# Altium schematic sheet MCU023_MSP432E_Ethernet_Power.SchDoc
size 431 x 279 mm; Date: Not shown in title block; ApprovedBy: Not shown in title block; CheckedBy: Not shown in title block; Author: Not shown in title block; CompanyName: Not shown in title block; Engineer: Not shown in title block; Organization: Not shown in title block; Address1: Not shown in title block; Address2: Not shown in title block; Address3: Not shown in title block; Address4: Not shown in title block; DocumentNumber: 1; Revision: Use project parameter SCH_Rev; SheetNumber: 2; SheetTotal: 6; PageSetup: Record=PageOptions|CenterHorizontal=True|CenterVertical=True|PrintScale=1.00|XCorrection=1.00|YCorrection=1.00|PrintKind=0|BorderSize=5000000|LeftOffset=0|BottomOffset=0|Orientation=2|PaperLength=1000|PaperWidth=1000|Scale=100|PaperSource=15|PrintQuality=600|MediaType=1|DitherType=10|PaperKind=Letter|PrintScaleMode=1; CurrentTime: Not shown in title block; CurrentDate: Not shown in title block; Time: Not shown in title block; DocumentFullPathAndName: Not shown in title block; DocumentName: Not shown in title block; ModifiedDate: Not shown in title block; ImagePath: Not shown in title block
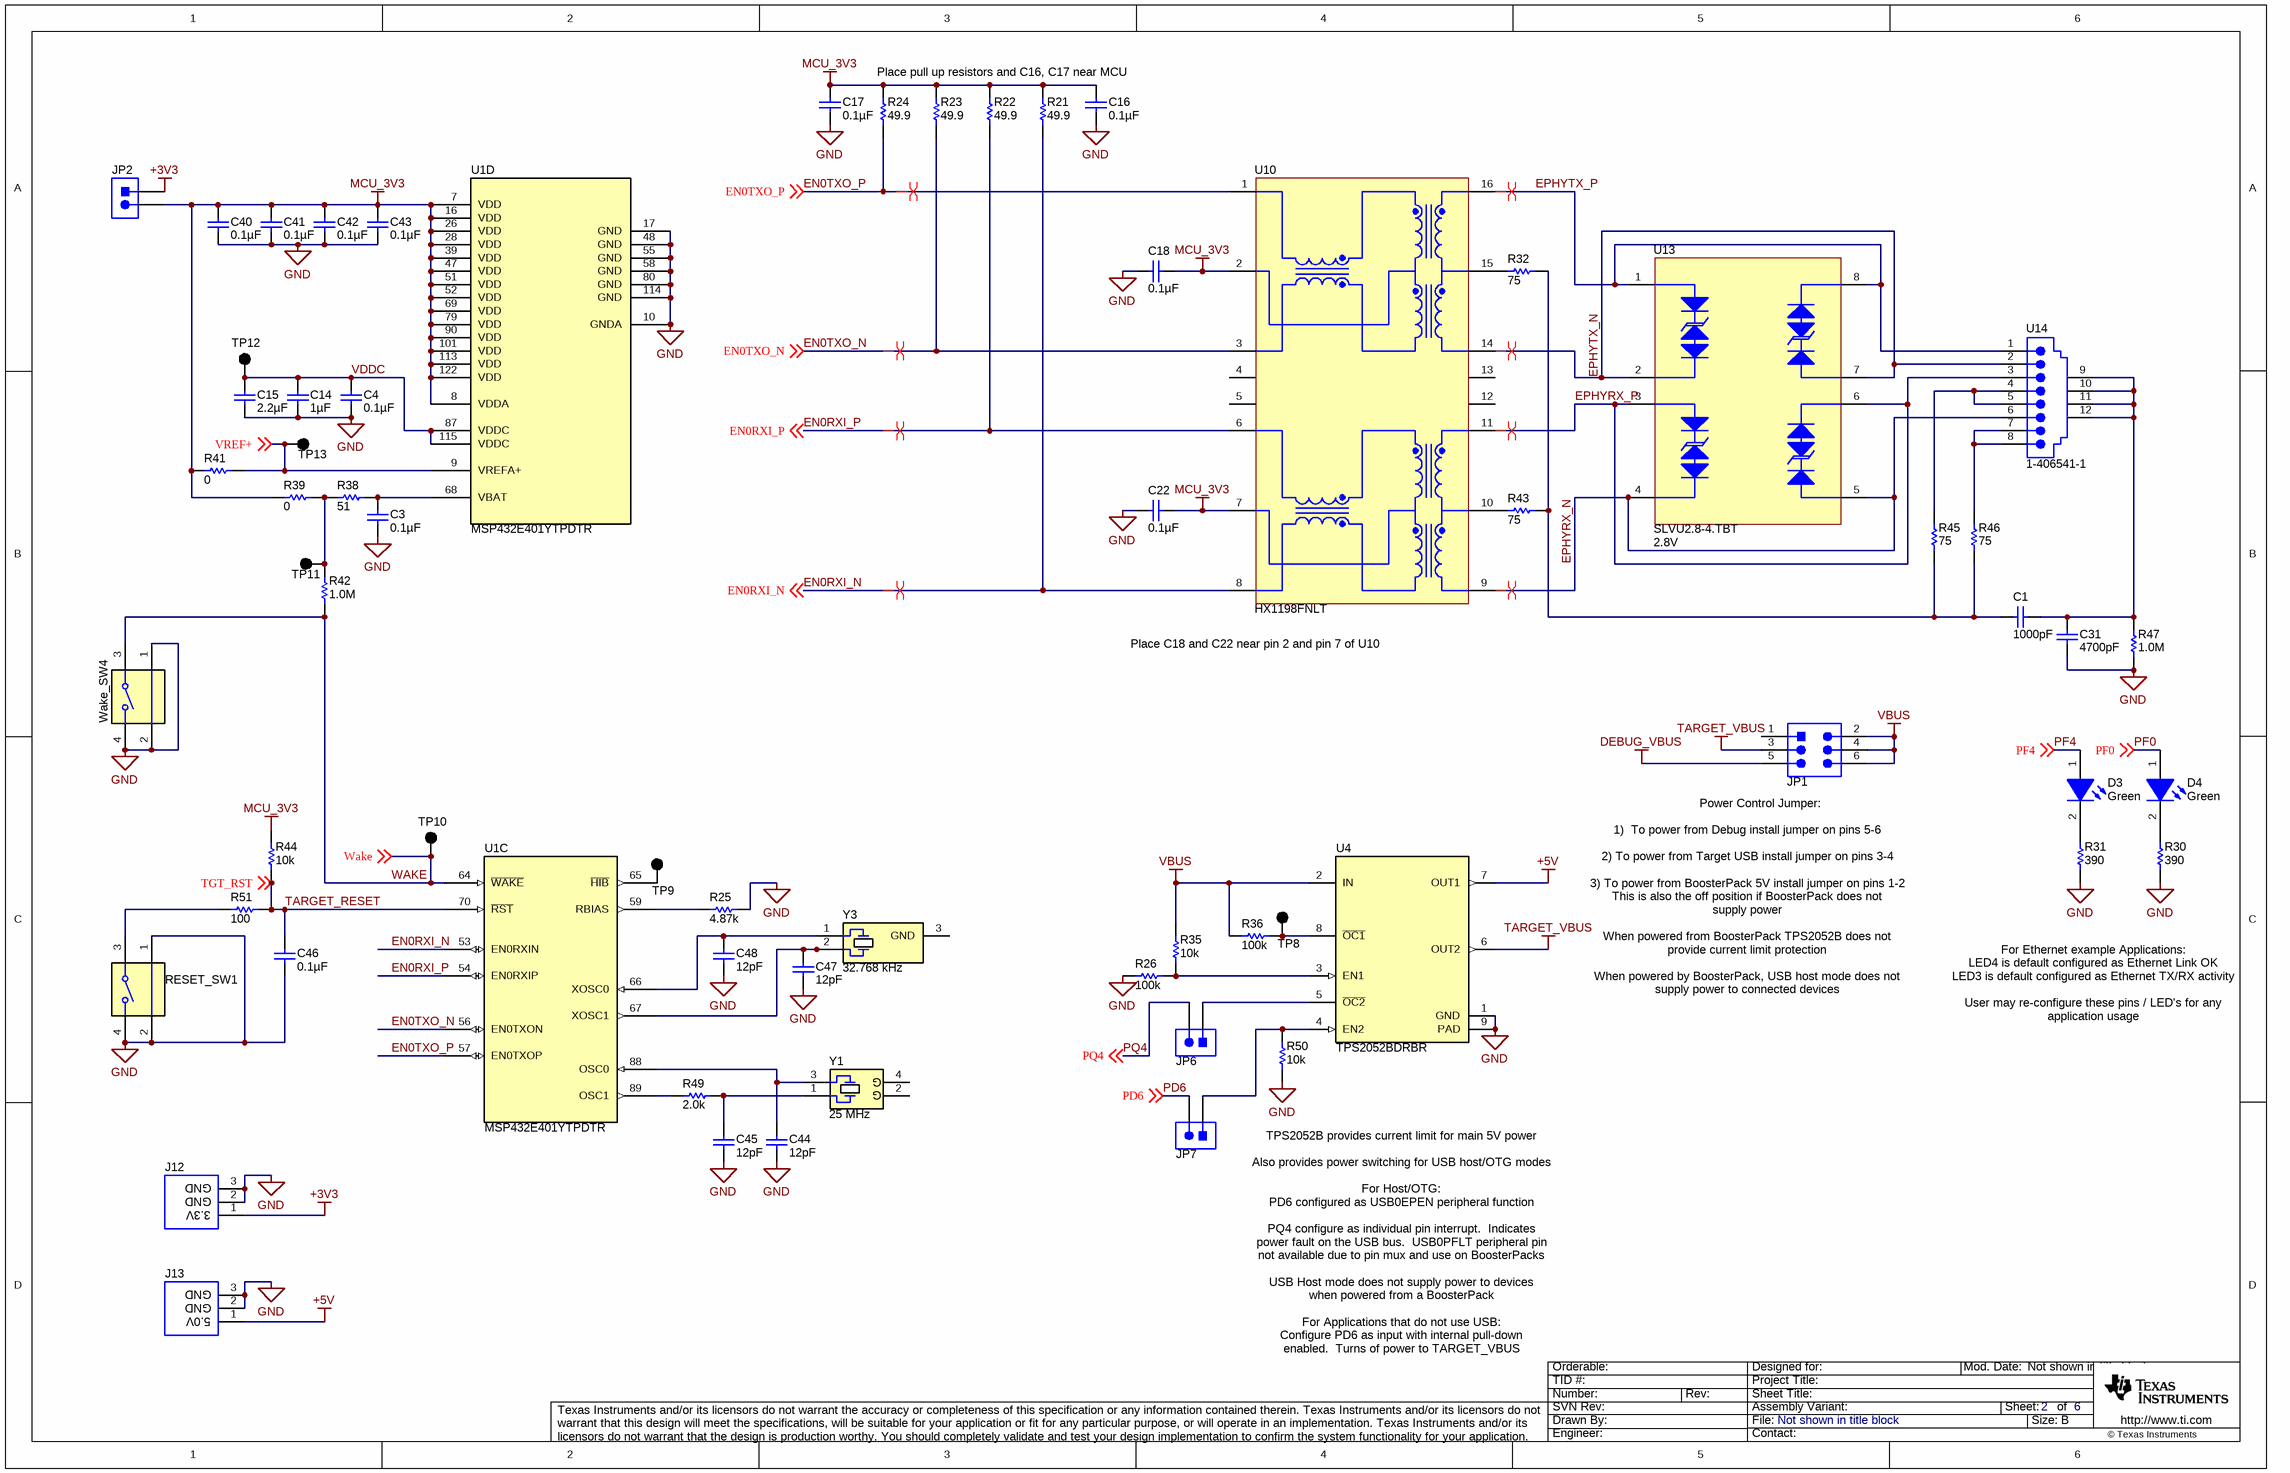
[diagram p0: MCU023_MSP432E_Ethernet_Power.SchDoc]

## Parts
C1  ValueDisplayed: 1000pF  [1210_270]  (hidden comment: C1210C102KGRACTU)
C3  ValueDisplayed: 0.1µF  [0402]  (hidden comment: GRM155R71C104KA88D)
C4  ValueDisplayed: 0.1µF  [0402]  (hidden comment: GRM155R71C104KA88D)
C14  ValueDisplayed: 1µF  [0402]  (hidden comment: GRM155R61A105KE15D)
C15  ValueDisplayed: 2.2µF  [0603]  (hidden comment: GRM188R61C225KE15D)
C16  ValueDisplayed: 0.1µF  [0402]  (hidden comment: GRM155R71C104KA88D)
C17  ValueDisplayed: 0.1µF  [0402]  (hidden comment: GRM155R71C104KA88D)
C18  ValueDisplayed: 0.1µF  [0402]  (hidden comment: GRM155R71C104KA88D)
C22  ValueDisplayed: 0.1µF  [0402]  (hidden comment: GRM155R71C104KA88D)
C31  ValueDisplayed: 4700pF  [1812_254]  (hidden comment: 1812GC472KAT1A)
C40  ValueDisplayed: 0.1µF  [0402]  (hidden comment: GRM155R71C104KA88D)
C41  ValueDisplayed: 0.1µF  [0402]  (hidden comment: GRM155R71C104KA88D)
C42  ValueDisplayed: 0.1µF  [0402]  (hidden comment: GRM155R71C104KA88D)
C43  ValueDisplayed: 0.1µF  [0402]  (hidden comment: GRM155R71C104KA88D)
C44  ValueDisplayed: 12pF  [0402]  (hidden comment: GRM1555C1H120JA01D)
C45  ValueDisplayed: 12pF  [0402]  (hidden comment: GRM1555C1H120JA01D)
C46  ValueDisplayed: 0.1µF  [0402]  (hidden comment: GRM155R71C104KA88D)
C47  ValueDisplayed: 12pF  [0402]  (hidden comment: GRM1555C1H120JA01D)
C48  ValueDisplayed: 12pF  [0402]  (hidden comment: GRM1555C1H120JA01D)
D3  value Green  [LED_LTST-C190]  (hidden comment: LTST-C190GKT)
D4  value Green  [LED_LTST-C190]  (hidden comment: LTST-C190GKT)
J12  PEC03SAAN  [PEC03SAAN_Launchpad_3V3]  (value not drawn)
J13  PEC03SAAN  [PEC03SAAN_Launchpad_5V0]  (value not drawn)
JP1  PEC03DAAN  [SULLINS_PEC03DAAN]  (value not drawn)
JP2  PEC02SAAN  [CONN_PEC02SAAN]  (value not drawn)
JP6  PEC02SAAN  [CONN_PEC02SAAN]  (value not drawn)
JP7  PEC02SAAN  [CONN_PEC02SAAN]  (value not drawn)
R21  ValueDisplayed: 49.9  [0402]  (hidden comment: CRCW040249R9FKED)
R22  ValueDisplayed: 49.9  [0402]  (hidden comment: CRCW040249R9FKED)
R23  ValueDisplayed: 49.9  [0402]  (hidden comment: CRCW040249R9FKED)
R24  ValueDisplayed: 49.9  [0402]  (hidden comment: CRCW040249R9FKED)
R25  ValueDisplayed: 4.87k  [0402]  (hidden comment: CRCW04024K87FKED)
R26  ValueDisplayed: 100k  [0402]  (hidden comment: CRCW0402100KJNED)
R30  ValueDisplayed: 390  [0402]  (hidden comment: CRCW0402390RJNED)
R31  ValueDisplayed: 390  [0402]  (hidden comment: CRCW0402390RJNED)
R32  ValueDisplayed: 75  [0402]  (hidden comment: CRCW040275R0JNED)
R35  ValueDisplayed: 10k  [0402]  (hidden comment: CRCW040210K0JNED)
R36  ValueDisplayed: 100k  [0402]  (hidden comment: CRCW0402100KJNED)
R38  ValueDisplayed: 51  [0402]  (hidden comment: CRCW040251R0JNED)
R39  ValueDisplayed: 0  [0402]  (hidden comment: ERJ-2GE0R00X)
R41  ValueDisplayed: 0  [0402]  (hidden comment: ERJ-2GE0R00X)
R42  ValueDisplayed: 1.0M  [0402]  (hidden comment: CRCW04021M00JNED)
R43  ValueDisplayed: 75  [0402]  (hidden comment: CRCW040275R0JNED)
R44  ValueDisplayed: 10k  [0402]  (hidden comment: CRCW040210K0JNED)
R45  ValueDisplayed: 75  [0402]  (hidden comment: CRCW040275R0JNED)
R46  ValueDisplayed: 75  [0402]  (hidden comment: CRCW040275R0JNED)
R47  ValueDisplayed: 1.0M  [1206]  (hidden comment: CRCW12061M00JNEA)
R49  ValueDisplayed: 2.0k  [0402]  (hidden comment: CRCW04022K00JNED)
R50  ValueDisplayed: 10k  [0402]  (hidden comment: CRCW040210K0JNED)
R51  ValueDisplayed: 100  [0402]  (hidden comment: CRCW0402100RJNED)
RESET_SW1  1188E-1K2-V-TR  [SW_1188E]  (value not drawn)
TP8  5001  [Keystone5001]  (value not drawn)
TP9  5001  [Keystone5001]  (value not drawn)
TP10  5001  [Keystone5001]  (value not drawn)
TP11  5001  [Keystone5001]  (value not drawn)
TP12  5001  [Keystone5001]  (value not drawn)
TP13  5001  [Keystone5001]  (value not drawn)
U1  MSP432E401YTPDTR  [PDT0128A]  (parts C,D of 4)
U4  TPS2052BDRBR  [DRB0008B]
U10  HX1198FNLT  [Pulse_HX1198FNLT]
U13  SLVU2.8-4.TBT  value 2.8V  [SOIC-8]
U14  1-406541-1  [TEC_1-406541-1]
Wake_SW4  1188E-1K2-V-TR  [SW_1188E]  (value not drawn)
Y1  Frequency_Fixed: 25 MHz  [NDK_NX3225GA]  (hidden comment: NX3225GA-25.000M-STD-CRG-2)
Y3  Frequency_Fixed: 32.768 kHz  [CFM_CMR200T]  (hidden comment: CMR200T-32.768KDZY-UT)

## Nets
+3V3: J12.1 JP2.1
+5V: J13.1 U4.7(OUT1)
DEBUG_VBUS: JP1.5
GND: C3.1 C4.1 C14.2 C15.2 C16.1 C17.1 C18.2 C22.2 C31.2 C40.1 C41.1 C42.1 C43.1 C44.2 C45.2 C46.1 C47.2 C48.2 J12.2 J12.3 J13.2 J13.3 R25.2 R26.1 R30.1 R31.1 R47.1 R50.1 RESET_SW1.1 RESET_SW1.2 RESET_SW1.4 U1.10(GNDA) U1.17(GND) U1.48(GND) U1.55(GND) U1.58(GND) U1.80(GND) U1.114(GND) U4.1(GND) U4.9(PAD) Wake_SW4.1 Wake_SW4.2 Wake_SW4.4
MCU_3V3: C16.2 C17.2 C18.1 C22.1 C40.2 C41.2 C42.2 C43.2 JP2.2 R21.2 R22.2 R23.2 R24.2 R39.1 R41.1 R44.2 U1.7(VDD) U1.8(VDDA) U1.16(VDD) U1.26(VDD) U1.28(VDD) U1.39(VDD) U1.47(VDD) U1.51(VDD) U1.52(VDD) U1.69(VDD) U1.79(VDD) U1.90(VDD) U1.101(VDD) U1.113(VDD) U1.122(VDD) U10.2(TCT) U10.7(RCT)
TARGET_VBUS: JP1.3 U4.6(OUT2)
VBUS: JP1.2 JP1.4 JP1.6 R35.2 R36.2 U4.2(IN)
EN0RXI_N: R21.1 U1.53(EN0RXIN) U10.8(RD-) ; off-sheet EN0RXI_N
EN0RXI_P: R22.1 U1.54(EN0RXIP) U10.6(RD+) ; off-sheet EN0RXI_P
EN0TXO_N: R23.1 U1.56(EN0TXON) U10.3(TD-) ; off-sheet EN0TXO_N
EN0TXO_P: R24.1 U1.57(EN0TXOP) U10.1(TD+) ; off-sheet EN0TXO_P
EPHYRX_N: U10.9(RX-) U13.4 U13.5 U14.6
EPHYRX_P: U10.11(RX+) U13.3 U13.6 U14.3
EPHYTX_N: U10.14(TX-) U13.2 U13.7 U14.2
EPHYTX_P: U10.16(TX+) U13.1 U13.8 U14.1
PD6: JP7.2 ; off-sheet PD6
PF0: D4.1(A) ; off-sheet PF0
PF4: D3.1(A) ; off-sheet PF4
PQ4: JP6.2 ; off-sheet PQ4
TARGET_RESET: C46.2 R44.1 R51.2 U1.70(~{RST}) ; off-sheet TGT_RST  [also labelled TGT_RST]
VDDC: C4.2 C14.1 C15.1 TP12.1 U1.87(VDDC) U1.115(VDDC)
VREF+: R41.2 TP13.1 U1.9(VREFA+) ; off-sheet VREF+
WAKE: R42.1 TP10.1 U1.64(~{WAKE}) Wake_SW4.3 ; off-sheet Wake
NetC1_1: C1.1 R32.1 R43.1 R45.1 R46.1
NetC1_2: C1.2 C31.1 R47.2 U14.9 U14.10 U14.11 U14.12
NetC3_2: C3.2 R38.1 U1.68(VBAT)
NetC44_1: C44.1 U1.88(OSC0) Y1.3
NetC45_1: C45.1 R49.2 Y1.1
NetC47_1: C47.1 U1.67(XOSC1) Y3.2
NetC48_1: C48.1 U1.66(XOSC0) Y3.1
NetD3_2: D3.2(K) R31.2
NetD4_2: D4.2(K) R30.2
NetJP6_1: JP6.1 U4.5(~{OC2})
NetJP7_1: JP7.1 R50.2 U4.4(EN2)
NetR25_1: R25.1 U1.59(RBIAS)
NetR26_2: R26.2 R35.1 U4.3(EN1)
NetR32_2: R32.2 U10.15(CMT)
NetR36_1: R36.1 TP8.1 U4.8(~{OC1})
NetR38_2: R38.2 R39.2 R42.2 TP11.1
NetR43_2: R43.2 U10.10(CMT)
NetR45_2: R45.2 U14.4 U14.5
NetR46_2: R46.2 U14.7 U14.8
NetR49_1: R49.1 U1.89(OSC1)
NetR51_1: R51.1 RESET_SW1.3
NetTP9_1: TP9.1 U1.65(~{HIB})

Not connected (* = marked no-connect by the designer): JP1 1; U10 4(NC) 5(NC) 12(NC) 13(NC); Y1 2(GND) 4(GND); Y3 3(GND)

## Layout directives
differential pair: EN0RXI_N, EN0RXI_P, EN0TXO_N, EN0TXO_P, EPHYRX_N, EPHYRX_P, EPHYTX_N, EPHYTX_P

## Notes on the sheet
- Place pull up resistors and C16, C17 near MCU
- (near U10) Place C18 and C22 near pin 2 and pin 7 of U10
- 1)  To power from Debug install jumper on pins 5-6
- (near JP1) Power Control Jumper:
- 2) To power from Target USB install jumper on pins 3-4
- 3) To power from BoosterPack 5V install jumper on pins 1-2
- This is also the off position if BoosterPack does not
- supply power
- When powered from BoosterPack TPS2052B does not
- provide current limit protection
- For Ethernet example Applications:
- LED4 is default configured as Ethernet Link OK
- When powered by BoosterPack, USB host mode does not
- supply power to connected devices
- LED3 is default configured as Ethernet TX/RX activity
- User may re-configure these pins / LED's for any
- application usage
- TPS2052B provides current limit for main 5V power
- Also provides power switching for USB host/OTG modes
- For Host/OTG:
- PD6 configured as USB0EPEN peripheral function
- PQ4 configure as individual pin interrupt.  Indicates
- power fault on the USB bus.  USB0PFLT peripheral pin
- not available due to pin mux and use on BoosterPacks
- USB Host mode does not supply power to devices
- when powered from a BoosterPack
- For Applications that do not use USB:
- Configure PD6 as input with internal pull-down
- enabled.  Turns of power to TARGET_VBUS
- Drawn By:
- SVN Rev:
- Number:
- TID #:
- Orderable:
- Rev:
- Sheet Title:
- File:
- Project Title:
- Designed for:
- Assembly Variant:
- Mod. Date:
- Sheet:
- Size:
- of
- B
- http://www.ti.com
- Texas Instruments and/or its licensors do not warrant the accuracy or completeness of this specification or any information contained therein. Texas Instruments and/or its licensors do not warrant that this design will meet the specifications, will be suitable for your application or fit for any particular purpose, or will operate in an implementation. Texas Instruments and/or its licensors do not warrant that the design is production worthy. You should completely validate and test your design implementation to confirm the system functionality for your application.
- Engineer:
- Contact:
- © Texas Instruments
- (in symbol NX3225GA-25.000M-STD-CRG-2) G
- (in symbol PEC03SAAN) GND; 5.0V; 3.3V

## Library data of the parts
C1 = C1210C102KGRACTU: CAP, CERM, 1000 pF, 2000 V, +/- 10%, X7R, 1210; Manufacturer: Kemet; Polarized: N; CompType: Capacitor; Value: 1000pF; U/M: EA; Cap_F: 0.000000001; Tolerance_%: 10; Value1: Unknown; VDC_V: 2000; Value2: 2000V; TaMin_C: -55; TaMax_C: 125; Cap_Case: 1210; SizeArea_mm2: 8; SizeAreaWB_mm2: 14.7; SizeX_mm: 3.2; SizeY_mm: 2.5; SizeZ_mm: 2.7; AEC Category: Q200; SymbolVersion: 2008-07-09; PartNumber: C1210C102KGRACTU; PackageReference: 1210; RoHS: Y; MountType: SMT; Technology: Ceramic; TempCo: X7R; Published: 2008-06-19; Publisher: Texas Instruments; LatestRevisionDate: 2017-04-12; ComponentLink1Description: Datasheet link; ComponentLink1URL: http://www.kemet.com/kemet/web/homepage/kechome.nsf/vapubfiles/KEM_C1010_X7R_HV_SMD.pdf/$file/KEM_C1010_X7R_HV_SMD.pdf; Supplier 1: Digi-Key; Supplier Part Number 1: 399-7095-1-ND; Supplier 2: Newark; Supplier Part Number 2: 24J4631; Supplier 3: Mouser; Supplier Part Number 3: 80-C1210C102KGR; AEC Qualified: N; AEC Grade: N/A
C3 C4 C16-C18 C22 C40-C43 C46 = GRM155R71C104KA88D: CAP, CERM, 0.1 µF, 16 V, +/- 10%, X7R, 0402; Manufacturer: MuRata; Polarized: N; CompType: Capacitor; Value: 0.1uF; U/M: EA; Cap_F: 0.0000001; Tolerance_%: 10; Value1: Unknown; VDC_V: 16; Value2: 16V; TaMin_C: -55; TaMax_C: 125; SizeArea_mm2: 0.5; SizeAreaWB_mm2: 3; SizeX_mm: 1; SizeZ_mm: 0.6; AEC Category: Q200; SymbolVersion: 2008-07-09; PartNumber: GRM155R71C104KA88D; PackageReference: 0402; RoHS: Y; MountType: SMT; Technology: Ceramic; TempCo: X7R; Cap_Case: 0402; SizeY_mm: 0.5; Published: 2008-06-19; Publisher: Texas Instruments; LatestRevisionDate: 2017-04-07; ComponentLink1Description: Datasheet link; ComponentLink1URL: http://search.murata.co.jp/Ceramy/PnsearchViewAction.do?HnOFG=ON&HnNFG=ON&SEL_CNT=50&sLang=en&sKey=GRM155R71C104KA88D&x=9&y=9&search=startwith; Supplier 1: Digi-Key; Supplier Part Number 1: 490-3261-1-ND; Supplier 2: Newark; Supplier Part Number 2: 38K1647; Supplier 3: Mouser; Supplier Part Number 3: 81-GRM155R71C104KA88; AEC Qualified: ?
C14 = GRM155R61A105KE15D: CAP, CERM, 1 µF, 10 V, +/- 10%, X5R, 0402; Manufacturer: MuRata; Polarized: N; CompType: Capacitor; Value: 1uF; U/M: EA; Cap_F: 0.000001; Tolerance_%: 10; Value1: Unknown; Value2: 10V; TaMin_C: -55; TaMax_C: 85; SizeArea_mm2: 0.5; SizeAreaWB_mm2: 3; SizeX_mm: 1; SizeZ_mm: 0.6; AEC Category: Q200; SymbolVersion: 2008-07-09; PartNumber: GRM155R61A105KE15D; PackageReference: 0402; RoHS: Y; VDC_V: 10; MountType: SMT; Technology: Ceramic; TempCo: X5R; Cap_Case: 0402; SizeY_mm: 0.5; Published: 2008-06-19; Publisher: Texas Instruments; LatestRevisionDate: 2017-04-12; ComponentLink1Description: Datasheet link; ComponentLink1URL: http://search.murata.co.jp/Ceramy/PnsearchViewAction.do?HnOFG=ON&HnNFG=ON&SEL_CNT=50&sLang=en&sKey=GRM155R61A105KE15D&x=9&y=9&search=startwith; Supplier 1: Digi-Key; Supplier Part Number 1: 490-3890-1-ND; Supplier 2: Mouser; Supplier Part Number 2: 81-GRM155R61A105KE15; Supplier 3: Farnell; Supplier Part Number 3: 1735523; AEC Qualified: ?
C15 = GRM188R61C225KE15D: CAP, CERM, 2.2 µF, 16 V, +/- 10%, X5R, 0603; Manufacturer: MuRata; Polarized: N; CompType: Capacitor; Value: 2.2uF; U/M: EA; Cap_F: 0.0000022; Tolerance_%: 10; Value1: Unknown; VDC_V: 16; Value2: 16V; TaMin_C: -55; TaMax_C: 85; SizeArea_mm2: 1.28; SizeAreaWB_mm2: 4.68; SizeX_mm: 1.6; SizeY_mm: 0.8; SizeZ_mm: 1; AEC Category: Q200; SymbolVersion: 2008-07-09; PartNumber: GRM188R61C225KE15D; PackageReference: 0603; RoHS: Y; MountType: SMT; Technology: Ceramic; TempCo: X5R; Cap_Case: 0603; Published: 2008-06-19; Publisher: Texas Instruments; LatestRevisionDate: 2017-04-12; ComponentLink1Description: Datasheet link; ComponentLink1URL: http://psearch.murata.com/capacitor/product/GRM188R61C225KE15%23.pdf; Supplier 1: Digi-Key; Supplier Part Number 1: 490-3296-1-ND; Supplier 2: Mouser; Supplier Part Number 2: 81-GRM188R61C225KE15; Supplier 3: Farnell; Supplier Part Number 3: 1735526; AEC Qualified: ?
C31 = 1812GC472KAT1A: CAP, CERM, 4700 pF, 2000 V, +/- 10%, X7R, 1812; Manufacturer: AVX; Polarized: N; CompType: Capacitor; Value: 4700pF; U/M: EA; Cap_F: 0.0000000047; Tolerance_%: 10; Value1: Unknown; VDC_V: 2000; Value2: 2000V; TaMin_C: -55; TaMax_C: 125; Cap_Case: 1812; SizeArea_mm2: 14.4; SizeAreaWB_mm2: 23.1; SizeX_mm: 4.5; SizeY_mm: 3.2; SizeZ_mm: 2.54; AEC Category: Q200; SymbolVersion: 2008-07-09; PartNumber: 1812GC472KAT1A; PackageReference: 1812; RoHS: Y; MountType: SMT; Technology: Ceramic; TempCo: X7R; Published: 2008-06-19; Publisher: Texas Instruments; LatestRevisionDate: 2017-04-12; ComponentLink1Description: Datasheet link; ComponentLink1URL: http://datasheets.avx.com/AVX-HV_MLCC.pdf; Supplier 1: Digi-Key; Supplier Part Number 1: 478-3003-1-ND; Supplier 2: Newark; Supplier Part Number 2: 18M6909; Supplier 3: Mouser; Supplier Part Number 3: 581-1812GC472K; AEC Qualified: N; AEC Grade: N/A
C44 C45 C47 C48 = GRM1555C1H120JA01D: CAP, CERM, 12 pF, 50 V, +/- 5%, C0G/NP0, 0402; Manufacturer: MuRata; Polarized: N; CompType: Capacitor; Value: 12pF; U/M: EA; Cap_F: 0.000000000012; Tolerance_%: 5; Value1: Unknown; VDC_V: 50; Value2: 50V; TaMin_C: -55; TaMax_C: 125; SizeArea_mm2: 0.5; SizeAreaWB_mm2: 3; SizeX_mm: 1; SizeZ_mm: 0.6; AEC Category: Q200; SymbolVersion: 2008-07-09; PartNumber: GRM1555C1H120JA01D; PackageReference: 0402; RoHS: Y; MountType: SMT; Technology: Ceramic; TempCo: C0G/NP0; Cap_Case: 0402; SizeY_mm: 0.5; Published: 2008-06-19; Publisher: Texas Instruments; LatestRevisionDate: 2017-04-15; ComponentLink1Description: Datasheet link; ComponentLink1URL: http://search.murata.co.jp/Ceramy/PnsearchViewAction.do?HnOFG=ON&HnNFG=ON&SEL_CNT=50&sLang=en&sKey=GRM1555C1H120JA01D&x=9&y=9&search=startwith; Supplier 1: Newark; Supplier Part Number 1: 14T3292; Supplier 2: Mouser; Supplier Part Number 2: 81-GRM1555C1H120JA1D; Supplier 3: Farnell; Supplier Part Number 3: 1828875; AEC Qualified: ?
D3 D4 = LTST-C190GKT: LED, Green, SMD; Manufacturer: Lite-On; Vf_V: 2.1; Value2: 2.1V; Io_A: 0.02; Power_TotalModule: 0.1; Value1: 0.1W; U/M: EA; SymbolVersion: 2017-01-11; PartNumber: LTST-C190GKT; PackageReference: 1.6x0.8x0.8mm; RoHS: Y; CompType: LED; Type: ?; MountType: SMT; Color: green; Published: 2008-07-11; Publisher: Texas Instruments; ComponentLink1URL: https://sps06.itg.ti.com/sites/KMS/crossdivteams/altium/docs/ComponentDatasheets/LTST-C190GKT.pdf; ComponentLink1Description: Datasheet link; LatestRevisionDate: 2017-04-02; Supplier 1: Digi-Key; Supplier Part Number 1: 160-1183-1-ND; Supplier 2: Mouser; Supplier Part Number 2: 859-LTST-C190GKT
J12 J13 = PEC03SAAN: Header, 100mil, 3x1, Tin, TH; Manufacturer: Sullins Connector Solutions; SymbolCreator: a0412235; Pitch_mm: 2.54; Gender: Male; Shrouded: N; Row_Count: 1; Current_A: 3; Voltage_V: 1800; Cert_UL: Y; Green_Lifecycle: Not Set; Green_REACh: Incomplete; SymbolVersion: 2017-03-03; PartNumber: PEC03SAAN; PackageReference: Header, 3 PIN, 100mil, Tin; ClassName: Header; CompType: Header; RoHS: Y; MountType: TH; ComponentLink1Description: Datasheet URL; ComponentLink1URL: http://www.sullinscorp.com/catalogs/77_PAGE108-109_.100_MALE_HDR.pdf; Orientation: Vertical; PinCount: 3; ContactFinish: Tin; Color: Black; Publisher: Texas Instruments; LatestRevisionDate: 2017-05-08; Supplier 1: Digi-Key; Supplier Part Number 1: S1012E-03-ND; Green_EU RoHS: Incomplete; Green_EU RoHS-2: Incomplete
JP1 = PEC03DAAN: Header, 100mil, 3x2, Tin, TH; Manufacturer: Sullins Connector Solutions; SymbolCreator: a0412235; Pitch_mm: 2.54; Gender: Male; Shrouded: N; Row_Count: 2; Current_A: 3; Voltage_V: 1800; Cert_UL: Y; SymbolVersion: 2013-10-14; PartNumber: PEC03DAAN; PackageReference: 3x2 Header; ClassName: Header; CompType: Header; RoHS: Y; MountType: TH; ComponentLink1Description: Datasheet URL; ComponentLink1URL: http://www.sullinscorp.com/catalogs/77_PAGE108-109_.100_MALE_HDR.pdf; Orientation: Vertical; PinCount: 6; RowSpacing_mm: 2.54; ContactFinish: Tin; Color: Black; Publisher: Texas Instruments; LatestRevisionDate: 2017-04-11; Supplier 1: Digi-Key; Supplier Part Number 1: S2012E-03-ND
JP2 JP6 JP7 = PEC02SAAN: Header, 100mil, 2x1, Tin, TH; Manufacturer: Sullins Connector Solutions; SymbolCreator: a0412235; Pitch_mm: 2.54; Gender: Male; Shrouded: N; Row_Count: 1; Current_A: 3; Voltage_V: 1800; Cert_UL: Y; SymbolVersion: 2013-10-31; PartNumber: PEC02SAAN; PackageReference: Header, 2 PIN, 100mil, Tin; ClassName: Header; CompType: Header; RoHS: Y; MountType: TH; ComponentLink1Description: Datasheet URL; ComponentLink1URL: http://www.sullinscorp.com/catalogs/77_PAGE108-109_.100_MALE_HDR.pdf; Orientation: Vertical; PinCount: 2; ContactFinish: Tin; Color: Black; Publisher: Texas Instruments; LatestRevisionDate: 2017-04-11; Supplier 1: Digi-Key; Supplier Part Number 1: S1012E-02-ND
R21-R24 = CRCW040249R9FKED: RES, 49.9, 1%, 0.063 W, 0402; Manufacturer: Vishay-Dale; CompType: Resistor; Value: 49.9; Value_Code: 49R9; Tolerance_%: 1; Power_W: 0.063; Value2: 0.063W; VDC_V: 50; TempCo: 100 ppm/C; SizeArea_mm2: 0.5; SizeZ_mm: 0.6; EIA_Code: E96; U/M: EA; AEC Category: Q200; SymbolVersion: 2009-05-29; PartNumber: CRCW040249R9FKED; PackageReference: 0402; RoHS: Y; Res_ohm: 49.9; Value1: 1%; MountType: SMT; Technology: Thick Film; SizeX_mm: 1; SizeY_mm: 0.5; Published: 2008-06-26; Publisher: Texas Instruments; LatestRevisionDate: 2017-03-27; ComponentLink1Description: Datasheet link; ComponentLink1URL: http://www.vishay.com/docs/20035/dcrcwe3.pdf; Supplier 1: Digi-Key; Supplier Part Number 1: 541-49.9LCT-ND; Supplier 2: Newark; Supplier Part Number 2: 52K7114; Supplier 3: Mouser; Supplier Part Number 3: 71-CRCW0402-49.9-E3; AEC Qualified: ?
R25 = CRCW04024K87FKED: RES, 4.87 k, 1%, 0.063 W, 0402; Manufacturer: Vishay-Dale; CompType: Resistor; Value: 4.87k; Res_ohm: 4870; Value_Code: 4k87; Tolerance_%: 1; Power_W: 0.063; Value2: 0.063W; VDC_V: 50; TempCo: 100 ppm/C; SizeArea_mm2: 0.5; SizeZ_mm: 0.6; EIA_Code: E96; U/M: EA; AEC Category: Q200; SymbolVersion: 2009-05-29; PartNumber: CRCW04024K87FKED; PackageReference: 0402; RoHS: Y; Value1: 1%; MountType: SMT; Technology: Thick Film; SizeX_mm: 1; SizeY_mm: 0.5; Published: 2008-06-26; Publisher: Texas Instruments; LatestRevisionDate: 2017-04-13; ComponentLink1Description: Datasheet link; ComponentLink1URL: http://www.vishay.com/docs/20035/dcrcwe3.pdf; Supplier 1: Digi-Key; Supplier Part Number 1: 541-4.87KLCT-ND; Supplier 2: Newark; Supplier Part Number 2: 52K7047; Supplier 3: Mouser; Supplier Part Number 3: 71-CRCW0402-4.87K-E3; AEC Qualified: ?
R26 R36 = CRCW0402100KJNED: RES, 100 k, 5%, 0.063 W, 0402; Manufacturer: Vishay-Dale; CompType: Resistor; Value: 100k; Res_ohm: 100000; Tolerance_%: 5; Power_W: 0.063; Value2: 0.063W; VDC_V: 50; TempCo: 200 ppm/C; SizeArea_mm2: 0.5; SizeX_mm: 1; SizeZ_mm: 0.6; EIA_Code: E24; U/M: EA; AEC Category: Q200; SymbolVersion: 2009-05-29; PartNumber: CRCW0402100KJNED; PackageReference: 0402; RoHS: Y; Value_Code: 100k; Value1: 5%; MountType: SMT; Technology: Thick Film; SizeY_mm: 0.5; Published: 2008-06-26; Publisher: Texas Instruments; LatestRevisionDate: 2017-04-13; ComponentLink1Description: Datasheet link; ComponentLink1URL: http://www.vishay.com/docs/20035/dcrcwe3.pdf; Supplier 1: Digi-Key; Supplier Part Number 1: 541-100KJCT-ND; Supplier 2: Newark; Supplier Part Number 2: 59M6699; Supplier 3: Mouser; Supplier Part Number 3: 71-CRCW0402J-100K-E3; AEC Qualified: ?
R30 R31 = CRCW0402390RJNED: RES, 390, 5%, 0.063 W, 0402; Manufacturer: Vishay-Dale; CompType: Resistor; Value: 390; Value_Code: 390R; Tolerance_%: 5; Power_W: 0.063; Value2: 0.063W; VDC_V: 50; TempCo: 200 ppm/C; SizeArea_mm2: 0.5; SizeX_mm: 1; SizeZ_mm: 0.6; EIA_Code: E24; U/M: EA; AEC Category: Q200; SymbolVersion: 2009-05-29; PartNumber: CRCW0402390RJNED; PackageReference: 0402; RoHS: Y; Res_ohm: 390; Value1: 5%; MountType: SMT; Technology: Thick Film; SizeY_mm: 0.5; Published: 2008-06-26; Publisher: Texas Instruments; LatestRevisionDate: 2017-03-27; ComponentLink1Description: Datasheet link; ComponentLink1URL: http://www.vishay.com/docs/20035/dcrcwe3.pdf; Supplier 1: Digi-Key; Supplier Part Number 1: 541-390JCT-ND; Supplier 2: Newark; Supplier Part Number 2: 59M6731; Supplier 3: Mouser; Supplier Part Number 3: 71-CRCW0402J-390-E3; AEC Qualified: ?
R32 R43 R45 R46 = CRCW040275R0JNED: RES, 75, 5%, 0.063 W, 0402; Manufacturer: Vishay-Dale; CompType: Resistor; Value: 75; Value_Code: 75R0; Tolerance_%: 5; Power_W: 0.063; Value2: 0.063W; VDC_V: 50; TempCo: 200 ppm/C; SizeArea_mm2: 0.5; SizeX_mm: 1; SizeZ_mm: 0.6; EIA_Code: E24; U/M: EA; AEC Category: Q200; SymbolVersion: 2009-05-29; PartNumber: CRCW040275R0JNED; PackageReference: 0402; RoHS: Y; Res_ohm: 75; Value1: 5%; MountType: SMT; Technology: Thick Film; SizeY_mm: 0.5; Published: 2008-06-26; Publisher: Texas Instruments; LatestRevisionDate: 2017-03-27; ComponentLink1Description: Datasheet link; ComponentLink1URL: http://www.vishay.com/docs/20035/dcrcwe3.pdf; Supplier 1: Digi-Key; Supplier Part Number 1: 541-75JCT-ND; Supplier 2: Newark; Supplier Part Number 2: 59M6745; Supplier 3: Mouser; Supplier Part Number 3: 71-CRCW0402J-75-E3; AEC Qualified: ?
R35 R44 R50 = CRCW040210K0JNED: RES, 10 k, 5%, 0.063 W, 0402; Manufacturer: Vishay-Dale; CompType: Resistor; Value: 10k; Res_ohm: 10000; Value_Code: 10k0; Tolerance_%: 5; Power_W: 0.063; Value2: 0.063W; VDC_V: 50; TempCo: 200 ppm/C; SizeArea_mm2: 0.5; SizeX_mm: 1; SizeZ_mm: 0.6; EIA_Code: E24; U/M: EA; AEC Category: Q200; SymbolVersion: 2009-05-29; PartNumber: CRCW040210K0JNED; PackageReference: 0402; RoHS: Y; Value1: 5%; MountType: SMT; Technology: Thick Film; SizeY_mm: 0.5; Published: 2008-06-26; Publisher: Texas Instruments; LatestRevisionDate: 2017-03-27; ComponentLink1Description: Datasheet link; ComponentLink1URL: http://www.vishay.com/docs/20035/dcrcwe3.pdf; Supplier 1: Digi-Key; Supplier Part Number 1: 541-10KJCT-ND; Supplier 2: Newark; Supplier Part Number 2: 59M6696; Supplier 3: Mouser; Supplier Part Number 3: 71-CRCW0402J-10K-E3; AEC Qualified: ?
R38 = CRCW040251R0JNED: RES, 51, 5%, 0.063 W, 0402; Manufacturer: Vishay-Dale; CompType: Resistor; Value: 51; Value_Code: 51R0; Tolerance_%: 5; Power_W: 0.063; Value2: 0.063W; VDC_V: 50; TempCo: 200 ppm/C; SizeArea_mm2: 0.5; SizeX_mm: 1; SizeZ_mm: 0.6; EIA_Code: E24; U/M: EA; AEC Category: Q200; SymbolVersion: 2009-05-29; PartNumber: CRCW040251R0JNED; PackageReference: 0402; RoHS: Y; Res_ohm: 51; Value1: 5%; MountType: SMT; Technology: Thick Film; SizeY_mm: 0.5; Published: 2008-06-26; Publisher: Texas Instruments; LatestRevisionDate: 2017-03-27; ComponentLink1Description: Datasheet link; ComponentLink1URL: http://www.vishay.com/docs/20035/dcrcwe3.pdf; Supplier 1: Digi-Key; Supplier Part Number 1: 541-51JCT-ND; Supplier 2: Newark; Supplier Part Number 2: 72M6804; Supplier 3: Mouser; Supplier Part Number 3: 71-CRCW0402J-51-E3; AEC Qualified: ?
R39 R41 = ERJ-2GE0R00X: RES, 0, 5%, 0.063 W, 0402; Manufacturer: Panasonic; CompType: Resistor; Value: 0; Value_Code: 0000; Tolerance_%: 5; Power_W: 0.063; Value2: 0.063W; VDC_V: 50; TempCo: 600 ppm/C; SizeArea_mm2: 0.5; SizeX_mm: 1; SizeZ_mm: 0.6; EIA_Code: E24; U/M: EA; AEC Category: Q200; SymbolVersion: 2009-05-29; PartNumber: ERJ-2GE0R00X; PackageReference: 0402; RoHS: Y; Res_ohm: 0; Value1: 5%; MountType: SMT; Technology: Thick Film; SizeY_mm: 0.5; Published: 2008-06-26; Publisher: Texas Instruments; LatestRevisionDate: 2017-03-27; ComponentLink1Description: Datasheet link; ComponentLink1URL: http://www.panasonic.com/industrial/components/pdf/AOA0000CE1.pdf; Supplier 1: Digi-Key; Supplier Part Number 1: P0.0JCT-ND; Supplier 2: Newark; Supplier Part Number 2: 65T8307; Supplier 3: Mouser; Supplier Part Number 3: 667-ERJ-2GE0R00X; AEC Qualified: ?
R42 = CRCW04021M00JNED: RES, 1.0 M, 5%, 0.063 W, 0402; Manufacturer: Vishay-Dale; CompType: Resistor; Value: 1.0Meg; Res_ohm: 1000000; Value_Code: 1M00; Tolerance_%: 5; Power_W: 0.063; Value2: 0.063W; VDC_V: 50; TempCo: 200 ppm/C; SizeArea_mm2: 0.5; SizeX_mm: 1; SizeZ_mm: 0.6; EIA_Code: E24; U/M: EA; AEC Category: Q200; SymbolVersion: 2009-05-29; PartNumber: CRCW04021M00JNED; PackageReference: 0402; RoHS: Y; Value1: 5%; MountType: SMT; Technology: Thick Film; SizeY_mm: 0.5; Published: 2008-06-26; Publisher: Texas Instruments; LatestRevisionDate: 2017-03-27; ComponentLink1Description: Datasheet link; ComponentLink1URL: http://www.vishay.com/docs/20035/dcrcwe3.pdf; Supplier 1: Digi-Key; Supplier Part Number 1: 541-1.0MJCT-ND; Supplier 2: Newark; Supplier Part Number 2: 59M6694; Supplier 3: Mouser; Supplier Part Number 3: 71-CRCW0402J-1M-E3; AEC Qualified: ?
R47 = CRCW12061M00JNEA: RES, 1.0 M, 5%, 0.25 W, 1206; Manufacturer: Vishay-Dale; CompType: Resistor; Value: 1.0Meg; Res_ohm: 1000000; Value_Code: 1M00; Tolerance_%: 5; Power_W: 0.25; Value2: 0.25W; VDC_V: 200; TempCo: 200 ppm/C; SizeArea_mm2: 5.12; SizeX_mm: 3.2; SizeY_mm: 1.6; SizeZ_mm: 1.35; EIA_Code: E24; U/M: EA; AEC Category: Q200; SymbolVersion: 2009-05-29; PartNumber: CRCW12061M00JNEA; PackageReference: 1206; RoHS: Y; Value1: 5%; MountType: SMT; Technology: Thick Film; Published: 2008-06-26; Publisher: Texas Instruments; LatestRevisionDate: 2017-04-07; ComponentLink1Description: Datasheet link; ComponentLink1URL: http://www.vishay.com/docs/20035/dcrcwe3.pdf; Supplier 1: Digi-Key; Supplier Part Number 1: 541-1.0MECT-ND; Supplier 2: Newark; Supplier Part Number 2: 59M6941; Supplier 3: Mouser; Supplier Part Number 3: 71-CRCW1206J-1M-E3; AEC Qualified: ?
R49 = CRCW04022K00JNED: RES, 2.0 k, 5%, 0.063 W, 0402; Manufacturer: Vishay-Dale; CompType: Resistor; Value: 2.0k; Res_ohm: 2000; Value_Code: 2k00; Tolerance_%: 5; Power_W: 0.063; Value2: 0.063W; VDC_V: 50; TempCo: 200 ppm/C; SizeArea_mm2: 0.5; SizeX_mm: 1; SizeZ_mm: 0.6; EIA_Code: E24; U/M: EA; AEC Category: Q200; SymbolVersion: 2009-05-29; PartNumber: CRCW04022K00JNED; PackageReference: 0402; RoHS: Y; Value1: 5%; MountType: SMT; Technology: Thick Film; SizeY_mm: 0.5; Published: 2008-06-26; Publisher: Texas Instruments; LatestRevisionDate: 2017-04-13; ComponentLink1Description: Datasheet link; ComponentLink1URL: http://www.vishay.com/docs/20035/dcrcwe3.pdf; Supplier 1: Digi-Key; Supplier Part Number 1: 541-2.0KJCT-ND; Supplier 2: Newark; Supplier Part Number 2: 59M6709; Supplier 3: Mouser; Supplier Part Number 3: 71-CRCW0402J-2K-E3; AEC Qualified: ?
R51 = CRCW0402100RJNED: RES, 100, 5%, 0.063 W, 0402; Manufacturer: Vishay-Dale; CompType: Resistor; Value: 100; Value_Code: 100R; Tolerance_%: 5; Power_W: 0.063; Value2: 0.063W; VDC_V: 50; TempCo: 200 ppm/C; SizeArea_mm2: 0.5; SizeX_mm: 1; SizeZ_mm: 0.6; EIA_Code: E24; U/M: EA; AEC Category: Q200; SymbolVersion: 2009-05-29; PartNumber: CRCW0402100RJNED; PackageReference: 0402; RoHS: Y; Res_ohm: 100; Value1: 5%; MountType: SMT; Technology: Thick Film; SizeY_mm: 0.5; Published: 2008-06-26; Publisher: Texas Instruments; LatestRevisionDate: 2017-03-27; ComponentLink1Description: Datasheet link; ComponentLink1URL: http://www.vishay.com/docs/20035/dcrcwe3.pdf; Supplier 1: Digi-Key; Supplier Part Number 1: 541-100JCT-ND; Supplier 2: Newark; Supplier Part Number 2: 59M6700; Supplier 3: Mouser; Supplier Part Number 3: 71-CRCW0402J-100-E3; AEC Qualified: ?
RESET_SW1 Wake_SW4 = 1188E-1K2-V-TR: Switch, SPST, 0.05 A, 12 VDC, SMD; Manufacturer: Diptronics; SymbolCreator: Altium; SizeAreaWB_mm2: 53.9; SizeArea_mm2: 27.3; SizeX_mm: 7.8; SizeY_mm: 3.5; VDC_V: 12; PositionCount: 1; CurrentRating_mA: 50; SymbolVersion: 2017-02-06; PartNumber: 1188E-1K2-V-TR; MountType: SMT; SizeZ_mm: 3.5; ComponentLink1Description: Datasheet URL; ComponentLink1URL: http://www.dip.com.tw/en/en-product-information/en-switch004/item/download/1976_b080c057386714e3a6604cbe658b9df3; RoHS: Y; Circuit: SPST; Orientation: Side Actuated; CompType: Switch; PackageReference: 7.8x3.5mm; Publisher: Texas Instruments; LatestRevisionDate: 2017-04-05
TP8-TP13 = 5001: Test Point, Miniature, Black, TH; Manufacturer: Keystone; CompType: Test Point Loop; U/M: EA; Note: DNP; SymbolVersion: 2008-04-04; PartNumber: 5001; PackageReference: Black Miniature Testpoint; RoHS: Y; MountType: TH; ComponentLink1Description: Datasheet Link; ComponentLink1URL: http://www.keyelco.com/userAssets/file/M60-2p60.pdf; Value: Black; Publisher: Texas Instruments; LatestRevisionDate: 2015-08-25; Supplier 1: Digi-Key; Supplier Part Number 1: 36-5001-ND
U1 = TM4C1294NCPDTI3R: IoT enabled High performance 32-bit ARM(R) Cortex(R)-M4F based MCU, PDT0128A (TQFP-128); Manufacturer: Texas Instruments; SymbolCreator: a0411947; SizeArea_mm2: 256; SizeAreaWB_mm2: 324; SizeX_mm: 16; SizeZ_mm: 1.2; CompType: IC; U/M: EA; Note: TI Supplied; SymbolVersion: 2015-10-15; PartNumber: MSP432E401YTPDTR; PackageReference: PDT0128A; PackageDescription: TQFP-128; MountType: SMT; SizeY_mm: 16; ComponentLink1Description: Datasheet Link; ComponentLink1URL: http://www.ti.com/lit/ds/symlink/tm4c1294ncpdt.pdf; RoHS: Y; Publisher: Texas Instruments; LatestRevisionDate: 2017-03-30
U4 = TPS2052BDRBR: Current-Limited, Power-Distribution Switches, DRB0008B (VSON-8); Alternate PartNumber: TPS2052BDRBT; Manufacturer: Texas Instruments; SymbolCreator: a0411947; SizeArea_mm2: 9; SizeAreaWB_mm2: 16; SizeX_mm: 3; SizeZ_mm: 1; CompType: IC; U/M: EA; Note: TI Supplied; SymbolVersion: 2017-04-12; PartNumber: TPS2052BDRBR; PackageReference: DRB0008B; PackageDescription: VSON-8; MountType: SMT; SizeY_mm: 3; ComponentLink1Description: Datasheet Link; ComponentLink1URL: http://www.ti.com/lit/ds/symlink/tps2052b.pdf; RoHS: Y; Publisher: Texas Instruments; LatestRevisionDate: 2017-04-16; Alternate Manufacturer: Texas Instruments
U10 = CMP-0030426-2: Transformer, 350 uH, SMT; Manufacturer: Pulse Engineering; Green_Lifecycle: Not Set; Green_REACh: Incomplete; Value: 350uH; Lp: 350; Ind_H: 350µH; Supplier Part Number 2: 673-HX1198FNLT; Publisher: Texas Instruments; Supplier 2: Mouser; RoHS: Y; MountType: SMT; Green_EU RoHS-2: Incomplete; Supplier 1: Digi-Key; Green_EU RoHS: Incomplete; PackageReference: 12.7x9.09mm; CompType: Transformer; LatestRevisionDate: 2017-05-09; PartNumber: HX1198FNLT; ComponentLink1Description: Datasheet URL; Supplier Part Number 1: 553-2209-1-ND; ValueDisplayed: 350uH; ComponentLink1URL: http://productfinder.pulseeng.com/products/datasheets/HX1198FNL.pdf;jsessionid=741BCD40859F1B611B313F549D3EF800
U13 = SLVU2.8-4.TBT: Diode, TVS, Uni, 2.8 V, 15 Vc, SOIC-8; Manufacturer: Semtech; SymbolCreator: Altium; U/M: EA; Vr_V: 2.8; Value1: W; SizeAreaWB_mm2: 55.131; SizeArea_mm2: 29.351; SizeX_mm: 5.99; SizeY_mm: 4.9; SizeZ_mm: 1.75; AEC Category: Q101; SymbolVersion: 2014-10-22; PartNumber: SLVU2.8-4.TBT; PackageReference: SOIC-8; CompType: TVS; Vz_V: N/A; MountType: SMT; RoHS: Y; ComponentLink1Description: Datasheet link; ComponentLink1URL: http://www.semtech.com/images/datasheet/slvu2.8-4.pdf; Published: 2008-10-08; Publisher: Texas Instruments; LatestRevisionDate: 2017-04-12; LatestRevisionNote: Updated Supplier Data; Supplier 1: Digi-Key; Supplier Part Number 1: SLVU2.8-4CT-ND; Supplier 2: Newark; Supplier Part Number 2: 37K8425; Supplier 3: Farnell; Supplier Part Number 3: 1456390; AEC Qualified: ?
U14 = 1-406541-1: RJ-45, No LED, tab up, R/A, TH; Manufacturer: TE Connectivity; SymbolCreator: x0208326; CompType: Connector; ContactFinish: Gold; SymbolVersion: 2013-11-27; PartNumber: 1-406541-1; PackageReference: 16.26x14.54x15.75; RoHS: Y; MountType: TH; ComponentLink1Description: Datasheet URL; ComponentLink1URL: http://www.te.com/commerce/DocumentDelivery/DDEController?Action=showdoc&DocId=Customer+Drawing%7F406541%7FN%7Fpdf%7FEnglish%7FENG_CD_406541_N.pdf%7F1-406541-1; Color: Black; Publisher: Texas Instruments; LatestRevisionDate: 2017-04-06; Supplier 1: Digi-Key; Supplier Part Number 1: A97716-ND; Supplier 2: Newark; Supplier Part Number 2: 67K7510; Supplier 3: Mouser; Supplier Part Number 3: 571-1-406541-1
Y1 = NX3225GA-25.000M-STD-CRG-2: Crystal, 25 MHz, 8pF, SMD; Manufacturer: NDK; SymbolCreator: a0412235; U/M: EA; TaMin_C: -40; TaMax_C: 85; Frequency Stability: ±30ppm; SymbolVersion: 2016-1-26; PartNumber: NX3225GA-25.000M-STD-CRG-2; CompType: Crystal; PackageReference: 3.2x0.75x2.5mm; MountType: SMT; RoHS: Y; ComponentLink1Description: Datasheet Link; ComponentLink1URL: http://www.ndk.com/images/products/catalog/c_NX3225GA-STD-CRG-2_e.pdf; Publisher: Texas Instruments; LatestRevisionDate: 2017-04-17; Supplier 1: Digi-Key; Supplier Part Number 1: 644-1259-1-ND
Y3 = CMR200T-32.768KDZY-UT: Crystal, 32.768 MHz,  SMD; Manufacturer: Citizen Finetech Miyota; SymbolCreator: Altium; U/M: EA; TaMin_C: -40; TaMax_C: 85; Frequency Stability: ±20ppm; SymbolVersion: 2016-3-6; PartNumber: CMR200T-32.768KDZY-UT; CompType: Crystal; PackageReference: D1.9xL6mm; MountType: SMT; RoHS: Y; ComponentLink1Description: Datasheet Link; ComponentLink1URL: http://cfm.citizen.co.jp/english/product/pdf/CMR200T.pdf; Publisher: Texas Instruments; LatestRevisionDate: 2017-04-17; Supplier 1: Mouser; Supplier Part Number 1: 695-CMR200T32.7KY-U; Supplier 2: Farnell; Supplier Part Number 2: 1703589RL